# EAGLE design NeoSevenSegment (EAGLE 8.6.3)
DATE: LAST_DATE_TIME; REV: 2; TITLE: Neo7Segment
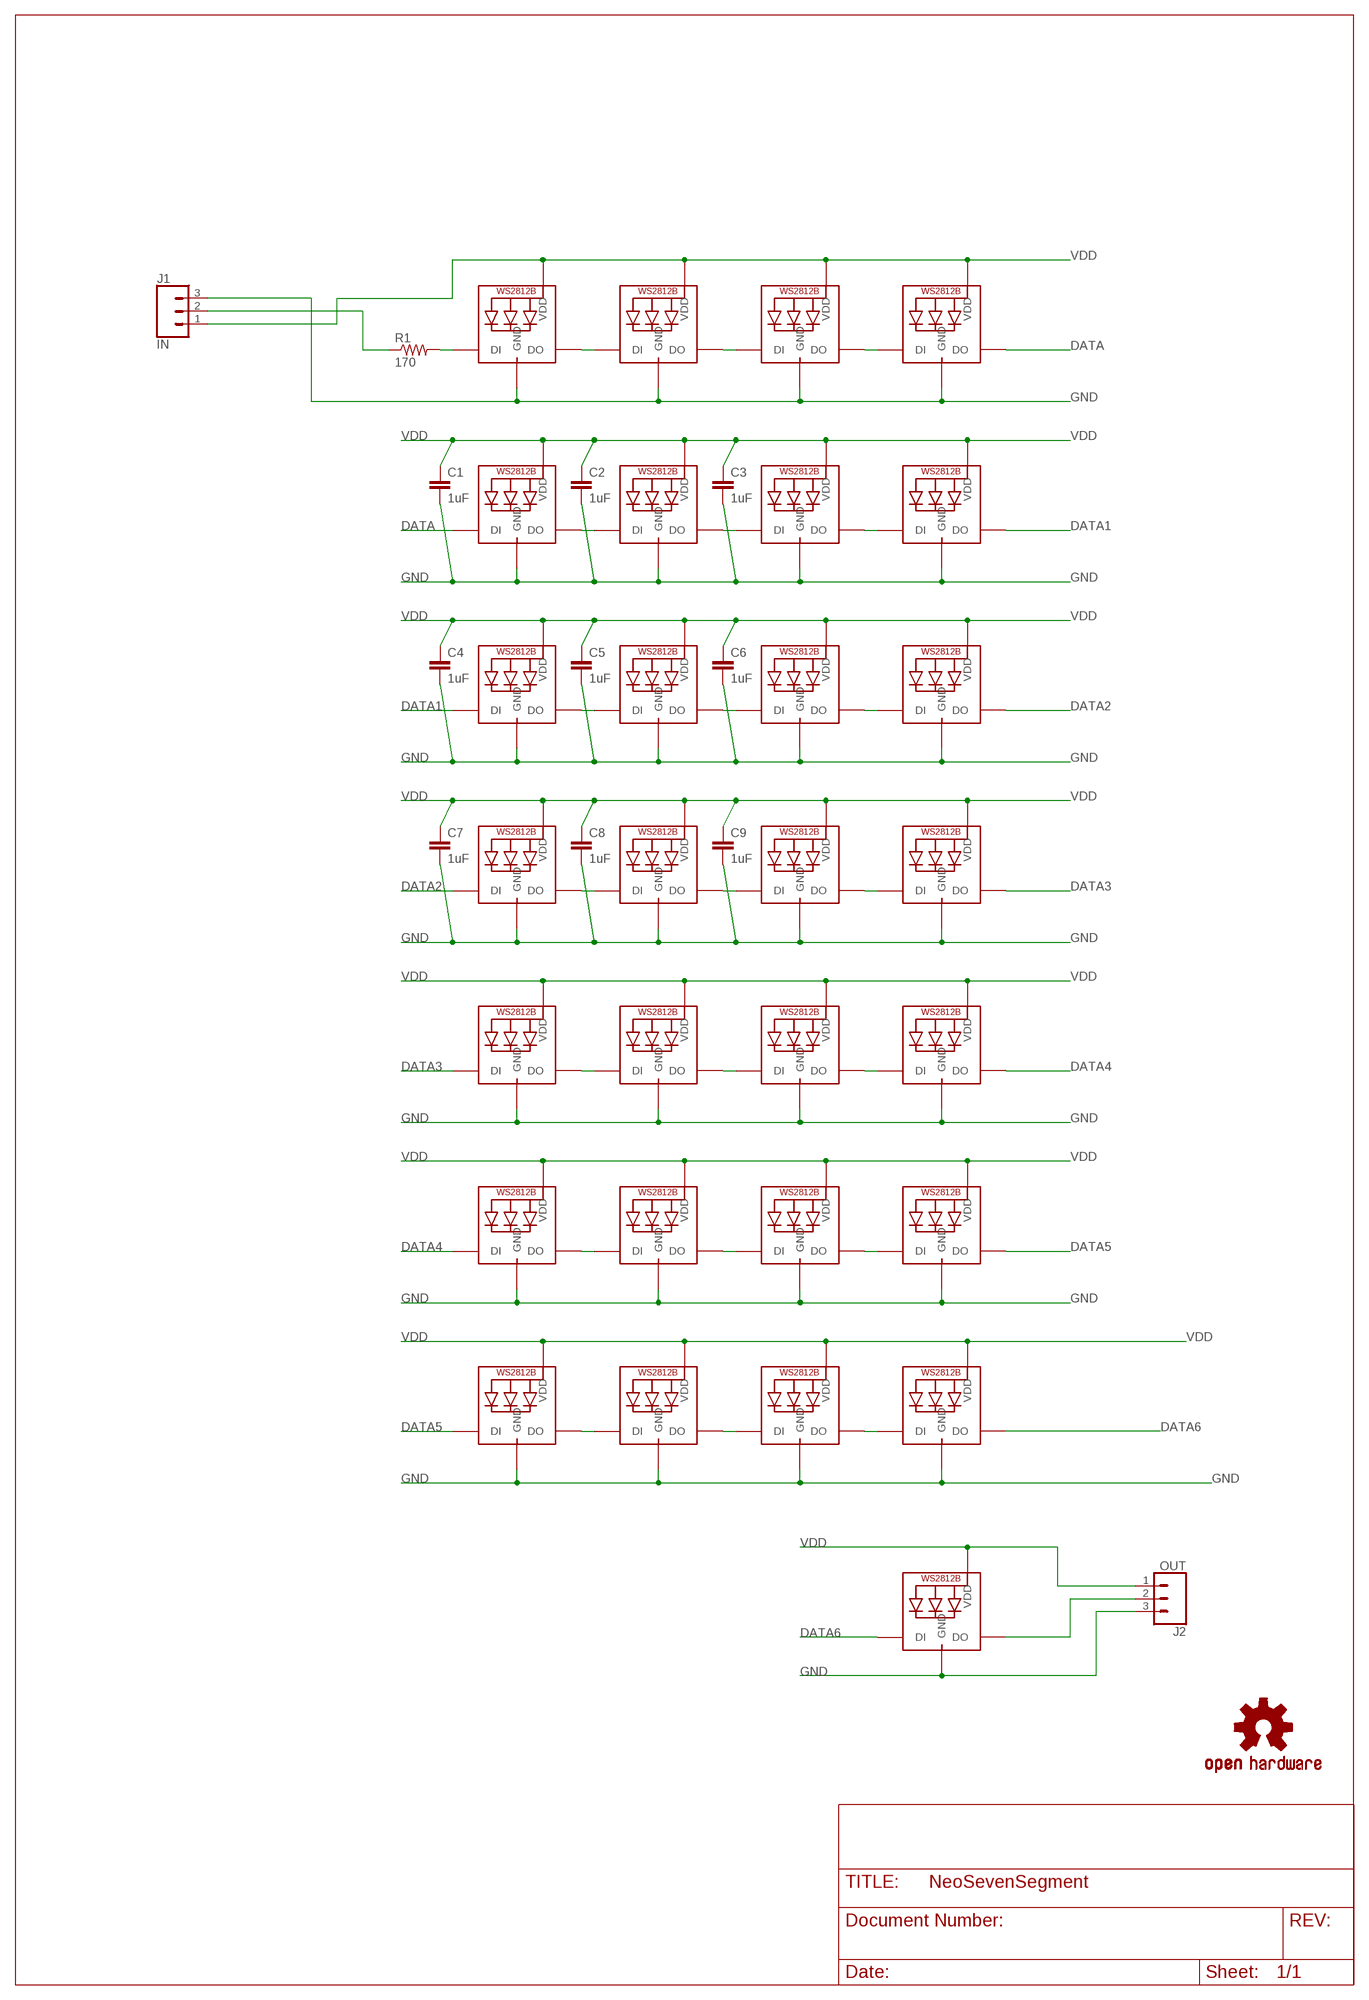
[diagram p0: schematic, sheet 1]

## Parts
C1  1uF  C-EUC0805  [C0805]
C2  1uF  C-EUC0805  [C0805]
C3  1uF  C-EUC0805  [C0805]
C4  1uF  C-EUC0805  [C0805]
C5  1uF  C-EUC0805  [C0805]
C6  1uF  C-EUC0805  [C0805]
C7  1uF  C-EUC0805  [C0805]
C8  1uF  C-EUC0805  [C0805]
C9  1uF  C-EUC0805  [C0805]
J1  IN  CONN_03LONGPADS  [1X03_LONGPADS]
J2  OUT  CONN_03LONGPADS  [1X03_LONGPADS]
LED1  WS2812B_5050N  [WS2812B-NARROW]
LED2  WS2812B_5050N  [WS2812B-NARROW]
LED3  WS2812B_5050N  [WS2812B-NARROW]
LED4  WS2812B_5050N  [WS2812B-NARROW]
LED5  WS2812B_5050N  [WS2812B-NARROW]
LED6  WS2812B_5050N  [WS2812B-NARROW]
LED7  WS2812B_5050N  [WS2812B-NARROW]
LED8  WS2812B_5050N  [WS2812B-NARROW]
LED9  WS2812B_5050N  [WS2812B-NARROW]
LED10  WS2812B_5050N  [WS2812B-NARROW]
LED11  WS2812B_5050N  [WS2812B-NARROW]
LED12  WS2812B_5050N  [WS2812B-NARROW]
LED13  WS2812B_5050N  [WS2812B-NARROW]
LED14  WS2812B_5050N  [WS2812B-NARROW]
LED15  WS2812B_5050N  [WS2812B-NARROW]
LED16  WS2812B_5050N  [WS2812B-NARROW]
LED17  WS2812B_5050N  [WS2812B-NARROW]
LED18  WS2812B_5050N  [WS2812B-NARROW]
LED19  WS2812B_5050N  [WS2812B-NARROW]
LED20  WS2812B_5050N  [WS2812B-NARROW]
LED21  WS2812B_5050N  [WS2812B-NARROW]
LED22  WS2812B_5050N  [WS2812B-NARROW]
LED23  WS2812B_5050N  [WS2812B-NARROW]
LED24  WS2812B_5050N  [WS2812B-NARROW]
LED25  WS2812B_5050N  [WS2812B-NARROW]
LED26  WS2812B_5050N  [WS2812B-NARROW]
LED27  WS2812B_5050N  [WS2812B-NARROW]
LED28  WS2812B_5050N  [WS2812B-NARROW]
LED29  RGB 3535  WS2812B3535  [LED3535]
LOGO1  OSHW-LOGOM  [OSHW-LOGO-M]
R1  170  R-US_R0805  [R0805]

## Nets
DATA: LED4.2-DOUT(DO) LED5.4-DIN(DI)
DATA1: LED8.2-DOUT(DO) LED9.4-DIN(DI)
DATA2: LED12.2-DOUT(DO) LED13.4-DIN(DI)
DATA3: LED16.2-DOUT(DO) LED17.4-DIN(DI)
DATA4: LED20.2-DOUT(DO) LED21.4-DIN(DI)
DATA5: LED24.2-DOUT(DO) LED25.4-DIN(DI)
DATA6: LED28.2-DOUT(DO) LED29.1(DI)
DATA_OUT: J2.2 LED29.3(DO)
DI: J1.2 R1.1
DI_R: LED1.4-DIN(DI) R1.2
GND: C1.2 C2.2 C3.2 C4.2 C5.2 C6.2 C7.2 C8.2 C9.2 J1.3 J2.3 LED1.3-GND(GND) LED2.3-GND(GND) LED3.3-GND(GND) LED4.3-GND(GND) LED5.3-GND(GND) LED6.3-GND(GND) LED7.3-GND(GND) LED8.3-GND(GND) LED9.3-GND(GND) LED10.3-GND(GND) LED11.3-GND(GND) LED12.3-GND(GND) LED13.3-GND(GND) LED14.3-GND(GND) LED15.3-GND(GND) LED16.3-GND(GND) LED17.3-GND(GND) LED18.3-GND(GND) LED19.3-GND(GND) LED20.3-GND(GND) LED21.3-GND(GND) LED22.3-GND(GND) LED23.3-GND(GND) LED24.3-GND(GND) LED25.3-GND(GND) LED26.3-GND(GND) LED27.3-GND(GND) LED28.3-GND(GND) LED29.4(GND)
N$25: LED9.2-DOUT(DO) LED10.4-DIN(DI)
N$27: LED10.2-DOUT(DO) LED11.4-DIN(DI)
N$28: LED11.2-DOUT(DO) LED12.4-DIN(DI)
N$29: LED1.2-DOUT(DO) LED2.4-DIN(DI)
N$30: LED2.2-DOUT(DO) LED3.4-DIN(DI)
N$31: LED3.2-DOUT(DO) LED4.4-DIN(DI)
N$32: LED13.2-DOUT(DO) LED14.4-DIN(DI)
N$33: LED14.2-DOUT(DO) LED15.4-DIN(DI)
N$34: LED15.2-DOUT(DO) LED16.4-DIN(DI)
N$35: LED17.2-DOUT(DO) LED18.4-DIN(DI)
N$36: LED18.2-DOUT(DO) LED19.4-DIN(DI)
N$37: LED5.2-DOUT(DO) LED6.4-DIN(DI)
N$38: LED6.2-DOUT(DO) LED7.4-DIN(DI)
N$39: LED7.2-DOUT(DO) LED8.4-DIN(DI)
N$40: LED19.2-DOUT(DO) LED20.4-DIN(DI)
N$41: LED21.2-DOUT(DO) LED22.4-DIN(DI)
N$42: LED22.2-DOUT(DO) LED23.4-DIN(DI)
N$43: LED23.2-DOUT(DO) LED24.4-DIN(DI)
S1: LED25.2-DOUT(DO) LED26.4-DIN(DI)
S2: LED26.2-DOUT(DO) LED27.4-DIN(DI)
S3: LED27.2-DOUT(DO) LED28.4-DIN(DI)
VDD: C1.1 C2.1 C3.1 C4.1 C5.1 C6.1 C7.1 C8.1 C9.1 J1.1 J2.1 LED1.1-VDD(VDD) LED2.1-VDD(VDD) LED3.1-VDD(VDD) LED4.1-VDD(VDD) LED5.1-VDD(VDD) LED6.1-VDD(VDD) LED7.1-VDD(VDD) LED8.1-VDD(VDD) LED9.1-VDD(VDD) LED10.1-VDD(VDD) LED11.1-VDD(VDD) LED12.1-VDD(VDD) LED13.1-VDD(VDD) LED14.1-VDD(VDD) LED15.1-VDD(VDD) LED16.1-VDD(VDD) LED17.1-VDD(VDD) LED18.1-VDD(VDD) LED19.1-VDD(VDD) LED20.1-VDD(VDD) LED21.1-VDD(VDD) LED22.1-VDD(VDD) LED23.1-VDD(VDD) LED24.1-VDD(VDD) LED25.1-VDD(VDD) LED26.1-VDD(VDD) LED27.1-VDD(VDD) LED28.1-VDD(VDD) LED29.2(VDD)

## Library data of the parts
C1-C9 = rcl:C-EU: CAPACITOR, European symbol
J1 J2 = SparkFun-Connectors:CONN_03: Multi connection point. Often used as Generic Header-pin footprint for 0.1 inch spaced/style header connections On any of the 0.1 inch spaced packages, you can populate with these: Break Away Headers - Straight <https://www.sparkfun.com/products/116> (PRT-00116) Break Away Male Headers - Right Angle <https://www.sparkfun.com/products/553> (PRT-00553) Female Headers <https://www.sparkfun.com/products/115> (PRT-00115) Break Away Headers - Machine Pin <https://www.sparkfun.com/products/117> (PRT-00117) Break Away Female Headers - Swiss Machine Pin <https://www.sparkfun.com/products/743> (PRT-00743) Stackable Header - 3 Pin (Female, 0.1") <https://www.sparkfun.com/products/13875> (PRT-13875) For SCREWTERMINALS and SPRING TERMINALS visit here: Screw Terimnals on SparkFun.com <https://www.sparkfun.com/search/results?term=Screw+Terminals> (5mm/3.5mm/2.54mm spacing) This device is also useful as a general connection point to wire up your design to another part of your project. Our various solder wires solder well into these plated through hole pads. Hook-Up Wire - Assortment (Stranded, 22 AWG) <https://www.sparkfun.com/products/11375> (PRT-11375) Hook-Up Wire - Assortment (Solid Core, 22 AWG) <https://www.sparkfun.com/products/11367> (PRT-11367) View the entire wire category on our website here <https://www.sparkfun.com/categories/141> Special notes: Molex polarized connector foot print use with SKU : PRT-08232 with associated crimp pins and housings.
LED1-LED29 = adafruit:WS2812B
LOGO1 = SparkFun-Aesthetics:OSHW-LOGO: Open-Source Hardware (OSHW) Logo This logo indicates the piece of hardware it is found on incorporates a OSHW license and/or adheres to the definition of open source hardware found here: http://freedomdefined.org/OSHW
R1 = rcl:R-US_: RESISTOR, American symbol; SPICEPREFIX: R

## Net classes
0 default: width 0.203 mm, drill 0.483 mm, clearance 0.102 mm

## Board
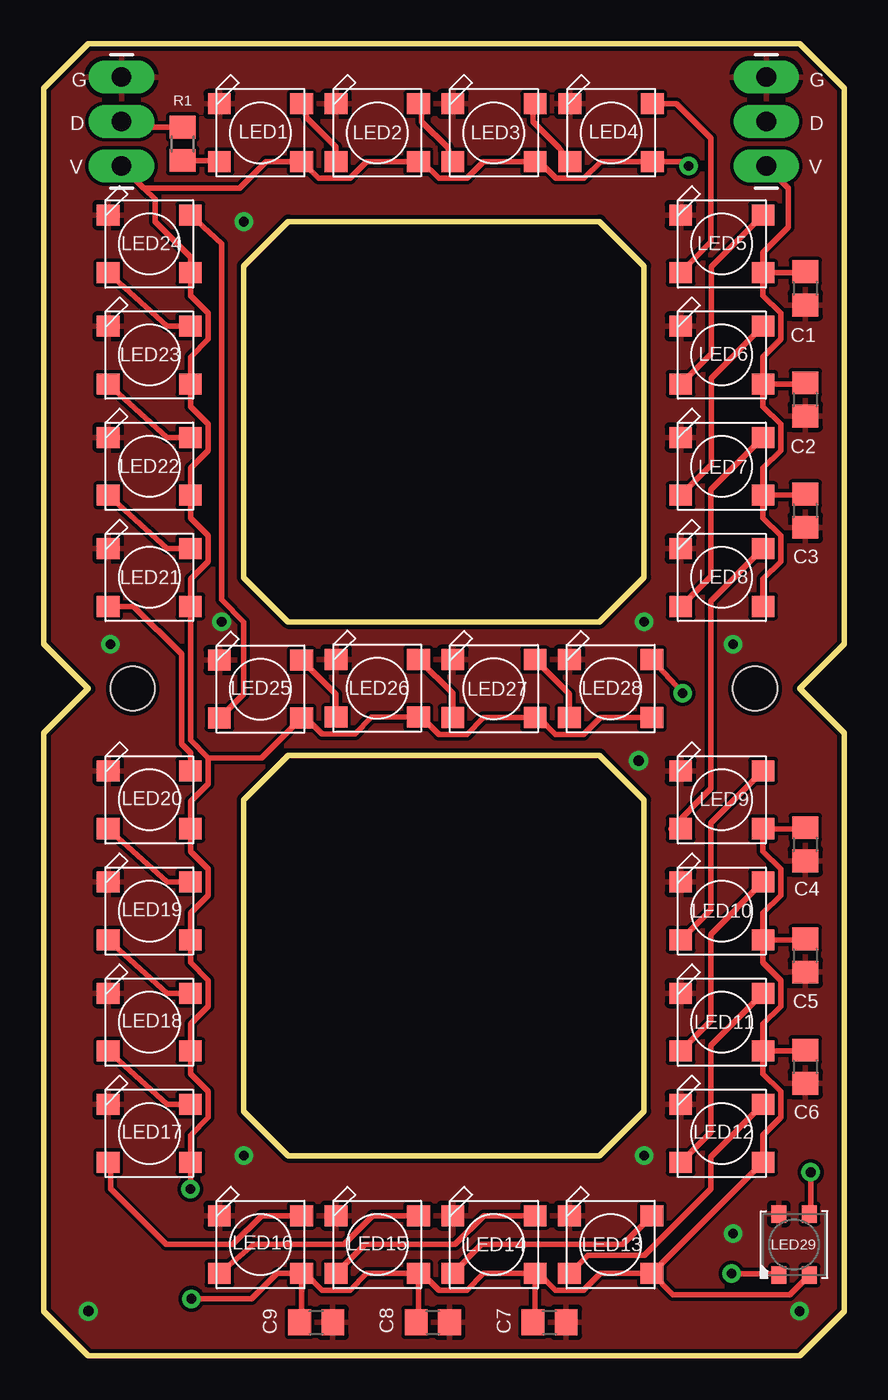
[diagram p1: board, top side]
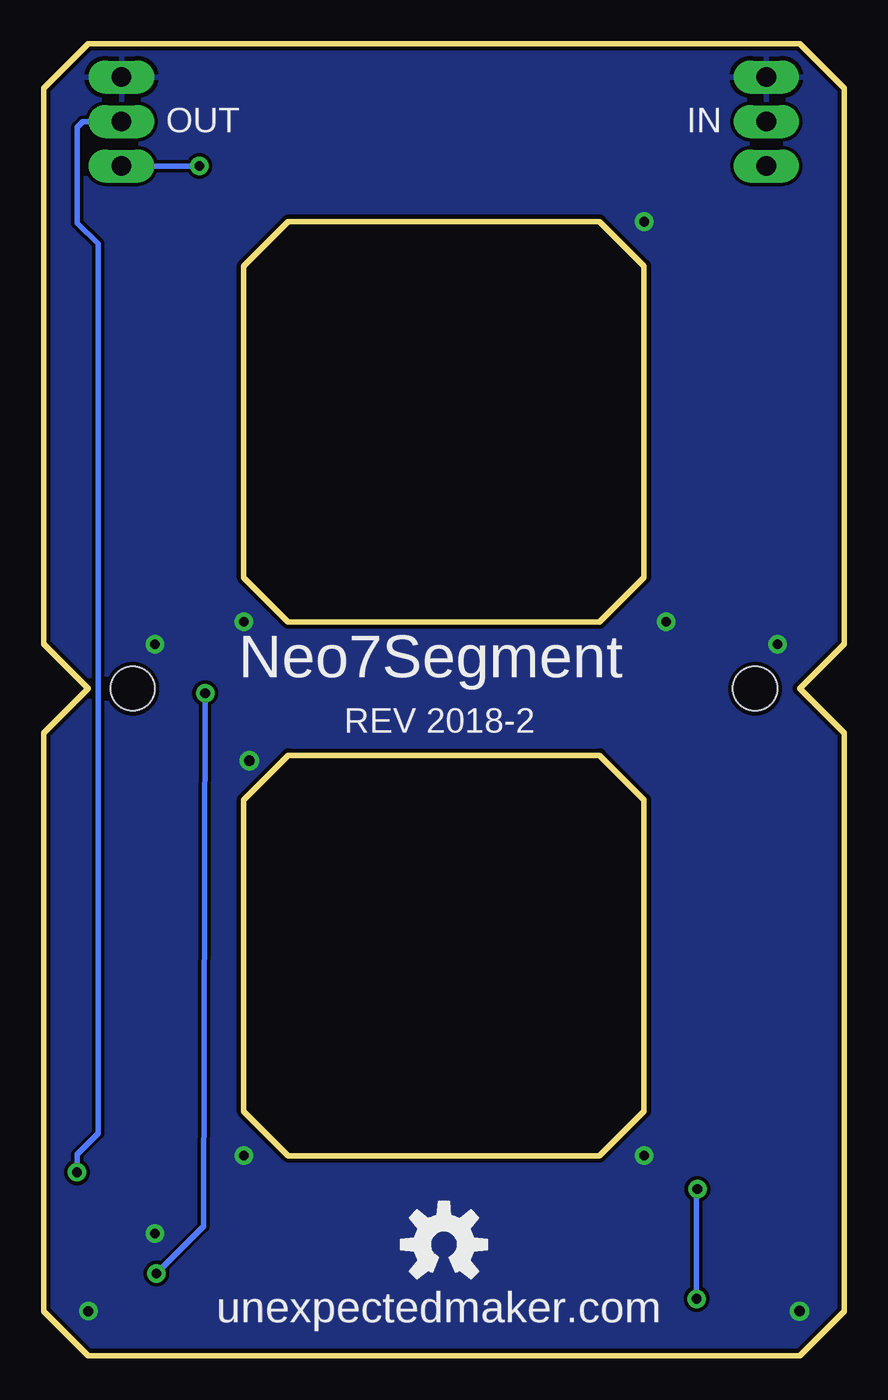
[diagram p2: board, bottom side, seen from below]

Size 45.72 x 74.93 mm. Coordinates in mm from the lower left corner, seen from the top.
Outline: 0,72.39 0,40.64 2.54,38.1 0,35.56 0,2.54 2.54,0 43.18,0 45.72,2.54 45.72,35.56 43.18,38.1 45.72,40.64 45.72,72.39 43.18,74.93 2.54,74.93 0,72.39
Outline: 13.97,41.91 31.75,41.91 34.29,44.45 34.29,62.23 31.75,64.77 13.97,64.77 11.43,62.23 11.43,44.45 13.97,41.91
Outline: 13.97,34.29 11.43,31.75 11.43,13.97 13.97,11.43 31.75,11.43 34.29,13.97 34.29,31.75 31.75,34.29 13.97,34.29
Copper layers (1*16): Top 0.035mm / dielectric 1.5mm / Bottom 0.035mm
Design rules "SparkFun": minimum track width 8mil, minimum drill 20mil, track to track 8mil, track to pad 8mil, pad to pad 8mil, via to via 8mil, smd to smd 8mil, copper to edge 10mil, drill to drill 8mil, minimum pad ring 12mil, minimum via ring 10mil, stop-mask expansion 4mil, vias tented up to drill 25mil, thermal gap 10mil
Holes 2.54 mm at 5.08,38.1 40.64,38.1

### Footprints (pad centres in the part's own frame; a part is rotated, then mirrored left to right if it is on the bottom)
C0805 = smd 1.3 x 1.5: 1 -0.95,0; 2 0.95,0
1X03_LONGPADS = drill 1.118 pad 1.88 long: 1 0,0; 2 2.54,0; 3 5.08,0
WS2812B-NARROW = smd 1.3 x 1.2: 1-VDD 2.35,-1.65; 2-DOUT 2.35,1.65; 3-GND -2.35,1.65; 4-DIN -2.35,-1.65
LED3535 = smd 1 x 0.85: 1 -1.75,0.875; 2 -1.75,-0.875; 3 1.75,-0.875; 4 1.75,0.875
R0805 = smd 1.3 x 1.5: 1 -0.95,0; 2 0.95,0

### Placement (x,y rotation side)
C1  43.5,60.96 270 top
C2  43.5,54.61 270 top
C3  43.5,48.26 270 top
C4  43.5,29.21 270 top
C5  43.5,22.86 270 top
C6  43.5,16.51 270 top
C7  28.89,1.91 0 top
C8  22.23,1.91 0 top
C9  15.56,1.91 0 top
J1  4.45,67.95 90 top
J2  41.27,67.95 90 top
LED1  12.38,69.85 0 top
LED2  19.05,69.85 0 top
LED3  25.72,69.85 0 top
LED4  32.41,69.85 0 top
LED5  38.73,63.5 0 top
LED6  38.73,57.15 0 top
LED7  38.73,50.8 0 top
LED8  38.73,44.45 0 top
LED9  38.73,31.75 0 top
LED10  38.73,25.4 0 top
LED11  38.73,19.05 0 top
LED12  38.73,12.7 0 top
LED13  32.39,6.35 0 top
LED14  25.72,6.35 0 top
LED15  19.05,6.35 0 top
LED16  12.38,6.35 0 top
LED17  6.03,12.7 0 top
LED18  6.03,19.05 0 top
LED19  6.03,25.4 0 top
LED20  6.03,31.75 0 top
LED21  6.03,44.45 0 top
LED22  6.03,50.8 0 top
LED23  6.03,57.15 0 top
LED24  6.03,63.5 0 top
LED25  12.38,38.07 0 top
LED26  19.05,38.13 0 top
LED27  25.72,38.1 0 top
LED28  32.39,38.1 0 top
LED29  42.86,6.35 90 top
LOGO1  22.86,6.35 0 bottom
R1  7.94,69.22 270 top

### Tracks (layer width: path | path; a pad name or v marks a point on that pad's centre or on a via)
DATA
  Top 0.305: LED5.4-DIN 38.1,63.63 38.1,66.04 38.1,66.67 38.1,69.53 36.13,71.5 LED4.2-DOUT
DATA1
  Top 0.305: LED9.4-DIN 35.82,30.1 38.1,32.39 38.1,43.11 LED8.2-DOUT
DATA2
  Top 0.305: LED12.2-DOUT 38.1,11.37 38.1,9.52 34.32,5.75 31.08,5.75 LED13.4-DIN
DATA3
  Top 0.305: LED16.2-DOUT 12.44,8 10.79,6.35 6.98,6.35 3.81,9.52 3.81,10.92 LED17.4-DIN
DATA4
  Top 0.305: LED21.4-DIN 5.14,42.8 7.87,40.07 7.87,34.94 8.38,34.43 LED20.2-DOUT
DATA5
  Top 0.305: LED24.2-DOUT 10.16,63.5 10.16,43.18 11.43,41.91 11.43,37.78 LED25.4-DIN
DATA6  (via drill 0.55)
  Top 0.305: LED29.1 41.9,4.69 v39.29,4.69 | LED28.2-DOUT v36.5,37.85
  Bottom 0.305: v39.29,4.69 36.59,7.38 v36.5,37.85
DATA_OUT  (via drill 0.55)
  Top 0.305: v43.82,10.48 43.82,8.18 LED29.3
  Bottom 0.305: J2.2 43.5,70.48 43.82,70.17 43.82,64.69 42.62,63.5 42.62,12.7 43.82,11.51 v43.82,10.48
DI
  Top 0.305: 7.62,70.48 R1.1 4.77,70.17 J1.2
DI_R
  Top 0.305: R1.2 9.97,68.27 LED1.4-DIN
GND  (via drill 0.55, 0.6)
  other vias: 11.43,11.43 34.29,11.43 33.97,33.97 34.29,41.91 3.81,40.64 39.37,40.64 2.54,2.54 10.16,41.91 43.18,2.54 11.43,64.77 39.37,6.98
  pour Top: -2.54,77.47 -2.54,-2.54 50.8,-2.54 50.8,77.47
  pour Bottom: -3.81,78.74 52.07,78.74 52.07,-5.08 -3.81,-5.08
N$25
  Top 0.305: LED10.4-DIN 38.1,25.47 38.1,30.42 LED9.2-DOUT
N$27
  Top 0.305: LED10.2-DOUT 38.1,24.07 38.1,19.12 LED11.4-DIN
N$28
  Top 0.305: LED11.2-DOUT 38.1,17.72 38.1,12.77 LED12.4-DIN
N$29
  Top 0.305: 15.24,71.31 LED1.2-DOUT 15.05,70.67 16.7,69.03 LED2.4-DIN
N$30
  Top 0.305: LED2.2-DOUT 21.59,71.31 21.59,70.48 23.05,69.03 LED3.4-DIN
N$31
  Top 0.305: LED3.2-DOUT 27.94,71.31 27.94,70.48 29.43,69 LED4.4-DIN
N$32
  Top 0.305: LED14.4-DIN 25.02,6.35 33.09,6.35 LED13.2-DOUT
N$33
  Top 0.305: LED14.2-DOUT 25.15,8 23.49,6.35 18.35,6.35 LED15.4-DIN
N$34
  Top 0.305: LED15.2-DOUT 18.8,8 17.15,6.35 12,6.35 LED16.4-DIN
N$35
  Top 0.305: LED17.2-DOUT 7.05,14.35 LED18.4-DIN
N$36
  Top 0.305: LED18.2-DOUT 7.05,20.7 LED19.4-DIN
N$37
  Top 0.305: LED5.2-DOUT 38.13,62.2 38.13,57.25 LED6.4-DIN
N$38
  Top 0.305: LED6.2-DOUT 38.13,55.85 38.13,50.9 LED7.4-DIN
N$39
  Top 0.305: LED7.2-DOUT 38.1,49.47 38.1,44.52 LED8.4-DIN
N$40
  Top 0.305: LED19.2-DOUT 7.05,27.05 LED20.4-DIN
N$41
  Top 0.305: LED21.2-DOUT 7.05,46.1 LED22.4-DIN
N$42
  Top 0.305: LED22.2-DOUT 7.05,52.45 LED23.4-DIN
N$43
  Top 0.305: LED23.2-DOUT 7.05,58.8 LED24.4-DIN
S1
  Top 0.305: LED25.2-DOUT 16.7,37.76 LED26.4-DIN
S2
  Top 0.305: LED26.2-DOUT 23.37,37.81 LED27.4-DIN
S3
  Top 0.305: LED27.2-DOUT 30.04,37.78 LED28.4-DIN
VDD  (via drill 0.55)
  Top 0.305: LED16.1-VDD 13.33,4.7 11.89,3.25 v8.43,3.25 | 15.01,36.42 LED25.1-VDD | LED25.1-VDD 15.05,36.37 15.9,35.52 17.78,35.52 18.74,36.48 LED26.1-VDD 21.59,36.48 22.57,35.49 24.16,35.49 25.12,36.45 LED27.1-VDD 28.28,36.45 29.24,35.49 30.83,35.49 31.79,36.45 LED28.1-VDD 35.18,36.45 | LED24.1-VDD 8.38,60.55 9.39,59.55 9.39,58.05 8.38,57.05 LED23.1-VDD 8.38,54.2 9.39,53.2 9.39,51.7 8.38,50.7 LED22.1-VDD 8.38,47.85 9.39,46.85 9.39,45.35 8.38,44.35 LED21.1-VDD 8.38,35.15 9.39,34.15 | LED5.1-VDD 41.09,60.55 42.09,59.55 42.09,58.05 41.09,57.05 LED6.1-VDD | LED6.1-VDD 41.09,54.2 42.09,53.2 42.09,51.7 41.09,50.7 LED7.1-VDD | LED7.1-VDD 41.09,47.85 42.09,46.85 42.09,45.35 41.09,44.35 LED8.1-VDD | 9.39,34.15 9.39,32.65 8.38,31.65 LED20.1-VDD 8.38,28.8 9.39,27.8 9.39,26.3 8.38,25.3 LED19.1-VDD 8.38,22.45 9.39,21.45 9.39,19.95 8.38,18.95 LED18.1-VDD 8.38,16.1 9.39,15.1 9.39,13.6 8.38,12.6 LED17.1-VDD v8.38,9.52 | LED10.1-VDD 41.09,25.3 42.09,26.3 42.09,27.8 41.09,28.8 LED9.1-VDD 43.44,30.1 C4.1 | LED10.1-VDD 41.09,22.45 42.09,21.45 42.09,19.95 41.09,18.95 LED11.1-VDD | LED11.1-VDD 41.09,16.1 42.09,15.1 42.09,13.6 41.09,12.6 LED12.1-VDD LED13.1-VDD | LED13.1-VDD 31.79,4.7 30.83,3.74 29.24,3.74 28.28,4.7 LED14.1-VDD | LED15.1-VDD 21.62,4.7 22.57,3.74 24.16,3.74 25.12,4.7 LED14.1-VDD | LED16.1-VDD 14.95,4.7 15.9,3.74 17.5,3.74 18.45,4.7 LED15.1-VDD | 9.39,34.15 12.46,34.15 LED25.1-VDD | 8,61.85 LED24.1-VDD | LED7.1-VDD 43.44,49.15 C3.1 | LED6.1-VDD 43.44,55.5 C2.1 | LED5.1-VDD 43.44,61.85 C1.1 | LED10.1-VDD 43.44,23.75 C5.1 | LED11.1-VDD 43.44,17.4 C6.1 | LED24.1-VDD 8.38,62.74 6.35,64.77 6.35,66.04 5.71,66.67
  Top 0.305: LED16.1-VDD 14.73,2.03 C9.1 | LED15.1-VDD 21.4,2.03 C8.1 | LED14.1-VDD 28.07,2.03 C7.1 | J1.1 5.71,66.67 | 5.71,66.67 11.17,66.67 12.7,68.2 LED1.1-VDD 15.69,67.24 17.5,67.24 18.45,68.2 LED2.1-VDD 21.62,68.2 22.57,67.24 24.16,67.24 25.12,68.2 LED3.1-VDD 28.31,68.2 29.26,67.24 30.86,67.24 31.81,68.2 LED4.1-VDD 36.45,68.2 v36.83,67.95 | LED5.1-VDD 41.09,62.99 42.55,64.45 42.55,66.67 J2.1 | LED13.1-VDD 35.94,3.49 42.63,3.49 LED29.2
  Bottom 0.305: v8.43,3.25 8.43,9.48 v8.38,9.52 | v36.83,67.95 J2.1

### Text on the board
tPlace: G | G | D | D | V | V
bPlace: IN | OUT | Neo7Segment | REV 2018-2 | unexpectedmaker.com